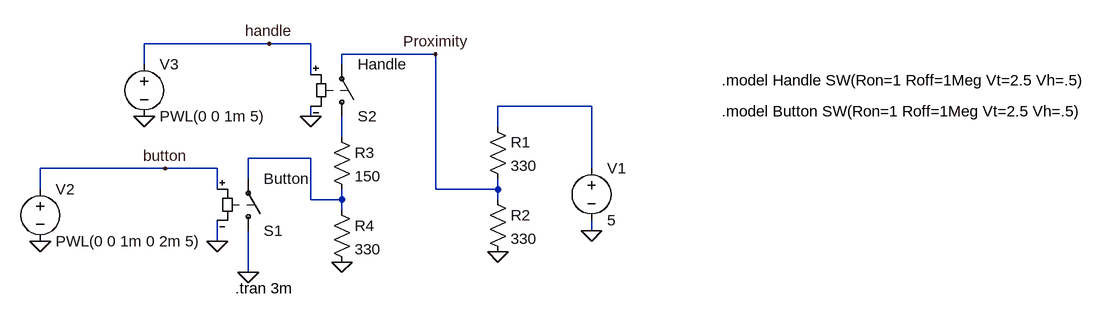
[diagram p0: schematic 1772_Proximity.asc]
1772_Proximity.asc, the LTspice schematic file:
Version 4
SHEET 1 1216 680
WIRE -64 -32 -256 -32
WIRE 0 -32 -64 -32
WIRE 192 -16 48 -16
WIRE -256 0 -256 -32
WIRE 48 0 48 -16
WIRE 0 16 0 -32
WIRE 432 64 288 64
WIRE 0 80 0 64
WIRE 288 96 288 64
WIRE 48 112 48 80
WIRE 0 144 -96 144
WIRE -224 160 -416 160
WIRE -144 160 -224 160
WIRE 432 160 432 64
WIRE -96 176 -96 144
WIRE -416 192 -416 160
WIRE -144 192 -144 160
WIRE 192 192 192 -16
WIRE 288 192 288 176
WIRE 288 192 192 192
WIRE 0 208 0 144
WIRE 48 208 48 192
WIRE 48 208 0 208
WIRE 288 208 288 192
WIRE 48 224 48 208
WIRE 432 256 432 240
WIRE -144 272 -144 240
WIRE -96 320 -96 256
FLAG 48 304 0
FLAG 288 288 0
FLAG 432 256 0
FLAG -96 320 0
FLAG 0 80 0
FLAG -144 272 0
FLAG -256 80 0
FLAG -416 272 0
FLAG 192 -16 Proximity
FLAG -64 -32 handle
FLAG -224 160 button
SYMBOL res 272 80 R0
SYMATTR InstName R1
SYMATTR Value 330
SYMBOL res 272 192 R0
SYMATTR InstName R2
SYMATTR Value 330
SYMBOL res 32 96 R0
SYMATTR InstName R3
SYMATTR Value 150
SYMBOL res 32 208 R0
SYMATTR InstName R4
SYMATTR Value 330
SYMBOL voltage 432 144 R0
WINDOW 123 0 0 Left 2
WINDOW 39 0 0 Left 2
SYMATTR InstName V1
SYMATTR Value 5
SYMBOL sw -96 272 M180
SYMATTR InstName S1
SYMATTR Value Button
SYMBOL sw 48 96 M180
SYMATTR InstName S2
SYMATTR Value Handle
SYMBOL voltage -416 176 R0
WINDOW 123 0 0 Left 2
WINDOW 39 0 0 Left 2
SYMATTR InstName V2
SYMATTR Value PWL(0 0 1m 0 2m 5)
SYMBOL voltage -256 -16 R0
WINDOW 123 0 0 Left 2
WINDOW 39 0 0 Left 2
SYMATTR InstName V3
SYMATTR Value PWL(0 0 1m 5)
TEXT -116 344 Left 2 !.tran 3m
TEXT 632 24 Left 2 !.model Handle SW(Ron=1 Roff=1Meg Vt=2.5 Vh=.5)
TEXT 632 72 Left 2 !.model Button SW(Ron=1 Roff=1Meg Vt=2.5 Vh=.5)

The netlist it stands for:
* 1772_Proximity.asc
R1 N001 Proximity 330
R2 Proximity 0 330
R3 N002 N003 150
R4 N003 0 330
V1 N001 0 5
S1 0 N003 button 0 Button
S2 N002 Proximity handle 0 Handle
V2 button 0 PWL(0 0 1m 0 2m 5)
V3 handle 0 PWL(0 0 1m 5)
.tran 3m
.model Handle SW(Ron=1 Roff=1Meg Vt=2.5 Vh=.5)
.model Button SW(Ron=1 Roff=1Meg Vt=2.5 Vh=.5)
.backanno
.end